# EAGLE design TSMPC (EAGLE 9.3.2)
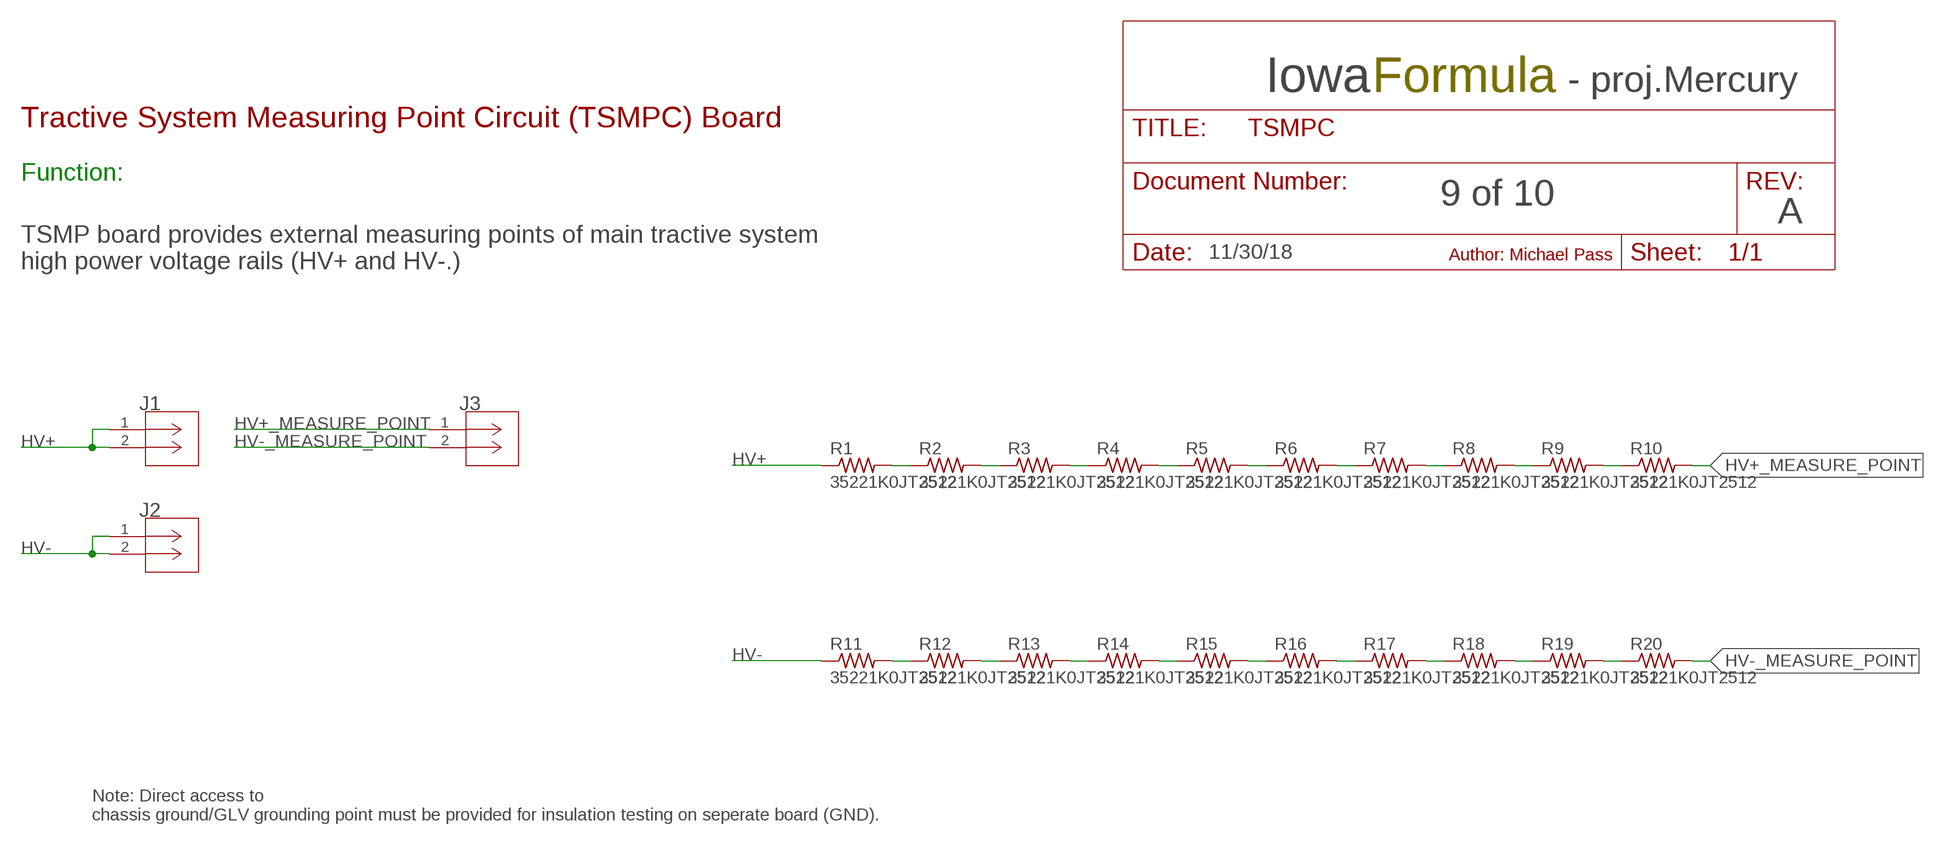
[diagram p0: schematic, sheet 1]

## Parts
J1  2P_1-770166-0  [CON2_1X2_P163_VMNL-1MTG]
J2  2P_1-770166-0  [CON2_1X2_P163_VMNL-1MTG]
J3  2P_1-770166-0  [CON2_1X2_P163_VMNL-1MTG]
R1  35221K0JT2512  [R2512]
R2  35221K0JT2512  [R2512]
R3  35221K0JT2512  [R2512]
R4  35221K0JT2512  [R2512]
R5  35221K0JT2512  [R2512]
R6  35221K0JT2512  [R2512]
R7  35221K0JT2512  [R2512]
R8  35221K0JT2512  [R2512]
R9  35221K0JT2512  [R2512]
R10  35221K0JT2512  [R2512]
R11  35221K0JT2512  [R2512]
R12  35221K0JT2512  [R2512]
R13  35221K0JT2512  [R2512]
R14  35221K0JT2512  [R2512]
R15  35221K0JT2512  [R2512]
R16  35221K0JT2512  [R2512]
R17  35221K0JT2512  [R2512]
R18  35221K0JT2512  [R2512]
R19  35221K0JT2512  [R2512]
R20  35221K0JT2512  [R2512]

## Nets
HV+: J1.1 J1.2 R1.1
HV+_MEASURE_POINT: J3.1 R10.2
HV-: J2.1 J2.2 R11.1
HV-_MEASURE_POINT: J3.2 R20.2
N$1: R1.2 R2.1
N$2: R2.2 R3.1
N$3: R3.2 R4.1
N$4: R4.2 R5.1
N$5: R5.2 R6.1
N$6: R6.2 R7.1
N$7: R7.2 R8.1
N$8: R8.2 R9.1
N$9: R9.2 R10.1
N$21: R11.2 R12.1
N$22: R12.2 R13.1
N$23: R13.2 R14.1
N$24: R14.2 R15.1
N$25: R15.2 R16.1
N$26: R16.2 R17.1
N$27: R17.2 R18.1
N$28: R18.2 R19.1
N$29: R19.2 R20.1

## Notes on the sheet
- Iowa | Formula | - proj.Mercury
- Tractive System Measuring Point Circuit (TSMPC) Board
- Function:
- 9 of 10
- A
- 11/30/18 | Author: Michael Pass
- TSMP board provides external measuring points of main tractive system
  high power voltage rails (HV+ and HV-.)
- Note: Direct access to
  chassis ground/GLV grounding point must be provided for insulation testing on seperate board (GND).

## Library data of the parts
J1-J3 = con-MATE-N-LOK:2P_1-770166-0; MANUFACTURER_PART_NUMBER: 17701660; VENDOR: TE Connectivity
R1-R20 = IowaFormula:35221K0JT

## Board
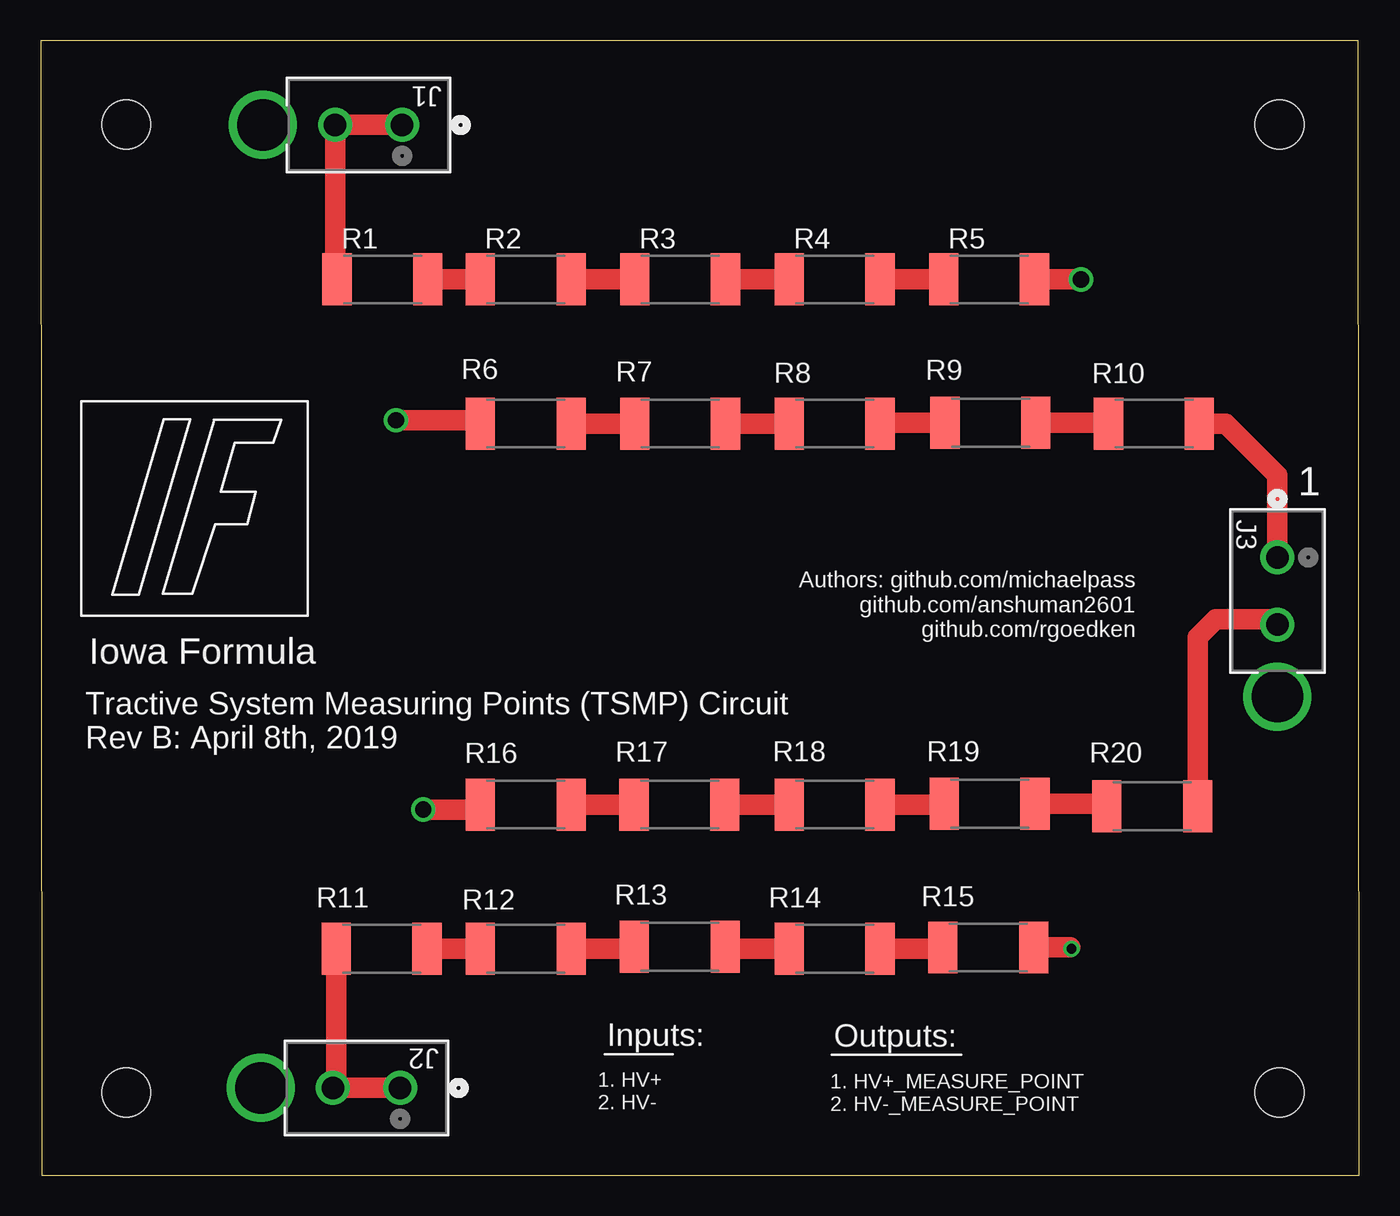
[diagram p1: board, top side]
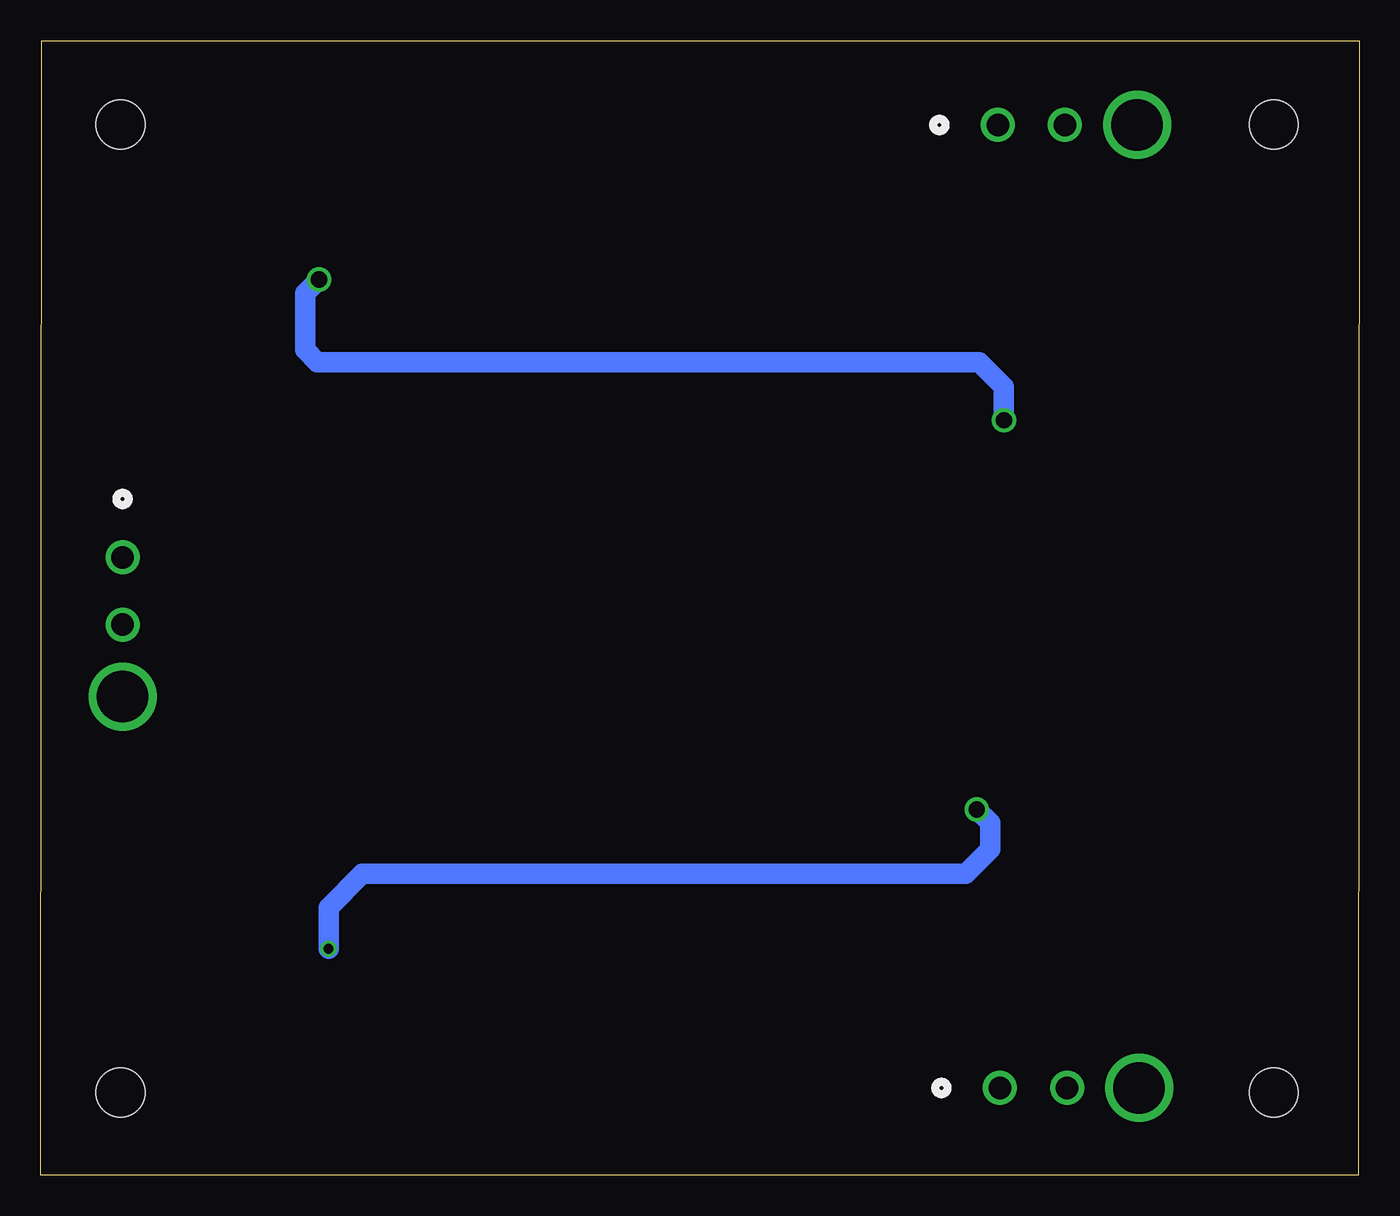
[diagram p2: board, bottom side, seen from below]

Size 81.34 x 69.98 mm. Coordinates in mm from the lower left corner, seen from the top.
Outline: 0.08,0 81.34,0 81.26,69.98 0,69.98 0.08,0
Copper layers (1*16): Top 0.035mm / dielectric 1.5mm / Bottom 0.035mm
Design rules "default": minimum track width 6mil, minimum drill 0.35mm, track to track 6mil, track to pad 6mil, pad to pad 6mil, via to via 6mil, smd to smd 6mil, copper to edge 40mil, drill to drill 6mil, minimum pad ring 10mil, minimum via ring 8mil, stop-mask expansion 4mil, vias tented up to drill 0mil, thermal gap 10mil
Holes 3 mm at 5.28,64.8 76.4,64.8 5.28,5.11 76.4,5.11

### Footprints (pad centres in the part's own frame; a part is rotated, then mirrored left to right if it is on the bottom)
CON2_1X2_P163_VMNL-1MTG = drill 1.397 pad 1.905: 1 0,0; 2 4.14,0 | drill 3.175 pad 3.175: 3 8.585,0
R2512 = smd 1.8 x 3.2: 1 -2.8,0; 2 2.8,0

### Placement (x,y rotation side)
J1  22.3,64.77 180 top
J2  22.17,5.38 180 top
J3  76.28,38.1 270 top
R1  21.08,55.24 0 top
R2  29.92,55.24 0 top
R3  39.45,55.24 0 top
R4  48.97,55.24 0 top
R5  58.5,55.24 0 top
R6  29.92,46.35 0 top
R7  39.45,46.35 0 top
R8  48.97,46.35 0 top
R9  58.57,46.41 0 top
R10  68.66,46.35 0 top
R11  21.03,13.97 0 top
R12  29.92,13.97 0 top
R13  39.42,14.1 0 top
R14  48.97,13.97 0 top
R15  58.45,14.05 0 top
R16  29.92,22.86 0 top
R17  39.4,22.86 0 top
R18  48.97,22.86 0 top
R19  58.52,22.91 0 top
R20  68.55,22.76 0 top

### Tracks (layer width: path | path; a pad name or v marks a point on that pad's centre or on a via)
HV+
  Top 0.813: 18.19,55.34 R1.1
  Top 1.27: J1.1 J1.2 18.19,55.34
HV+_MEASURE_POINT
  Top 1.27: R10.2 73.1,46.35 76.28,43.18 J3.1
HV-
  Top 1.27: J2.1 J2.2 18.23,5.58 R11.1
HV-_MEASURE_POINT
  Top 1.27: J3.2 75.95,34.29 72.47,34.29 71.35,33.18 R20.2
N$1
  Top 1.27: R1.2 R2.1
N$2
  Top 1.27: R3.1 R2.2
N$3
  Top 1.27: R4.1 R3.2
N$4
  Top 1.27: R4.2 R5.1
N$5  (via drill 1)
  Top 0.813: 26.92,46.56 R6.1
  Top 1.27: R5.2 v64.16,55.24 | v21.92,46.56 26.92,46.56
  Bottom 0.813: 21.94,46.58 v21.92,46.56
  Bottom 1.27: v64.16,55.24 65.02,54.38 65.02,50.9 64.26,50.14 23.44,50.14 21.94,48.64 21.94,46.58
N$6
  Top 1.27: R6.2 R7.1
N$7
  Top 1.27: R7.2 R8.1
N$8
  Top 0.813: R8.2 51.82,46.41
  Top 1.27: 51.82,46.41 R9.1
N$9
  Top 0.813: 65.81,46.41 R10.1
  Top 1.27: R9.2 65.81,46.41
N$21
  Top 1.27: R11.2 R12.1
N$22
  Top 0.813: 36.49,13.97 R13.1
  Top 1.27: R12.2 36.49,13.97
N$23
  Top 0.813: R13.2 42.35,13.97
  Top 1.27: 42.35,13.97 R14.1
N$24
  Top 0.813: 55.57,13.97 R15.1
  Top 1.27: R14.2 55.57,13.97
N$25  (via drill 0.6, 1)
  Top 0.813: 63.5,14.05 v63.58,13.97 | 26.82,22.55 R16.1
  Top 1.27: R15.2 63.5,14.05 | v23.6,22.55 26.82,22.55
  Bottom 1.27: v63.58,13.97 63.58,16.51 61.49,18.59 24.28,18.59 22.78,20.09 22.78,21.74 v23.6,22.55
N$26
  Top 1.27: R16.2 R17.1
N$27
  Top 1.27: R17.2 R18.1
N$28
  Top 0.813: 55.67,22.86 R19.1
  Top 1.27: R18.2 55.67,22.86
N$29
  Top 0.813: 65.6,22.91 R20.1
  Top 1.27: R19.2 65.6,22.91

### Text on the board
tNames: 1 | Authors: github.com/michaelpass / github.com/anshuman2601 / github.com/rgoedken | Iowa Formula | Tractive System Measuring Points (TSMP) Circuit / Rev B: April 8th, 2019 | Inputs: | Outputs: | 1. HV+ / 2. HV- | 1. HV+_MEASURE_POINT / 2. HV-_MEASURE_POINT